# Altium project ECEN2020_Final_Board.PrjPcb
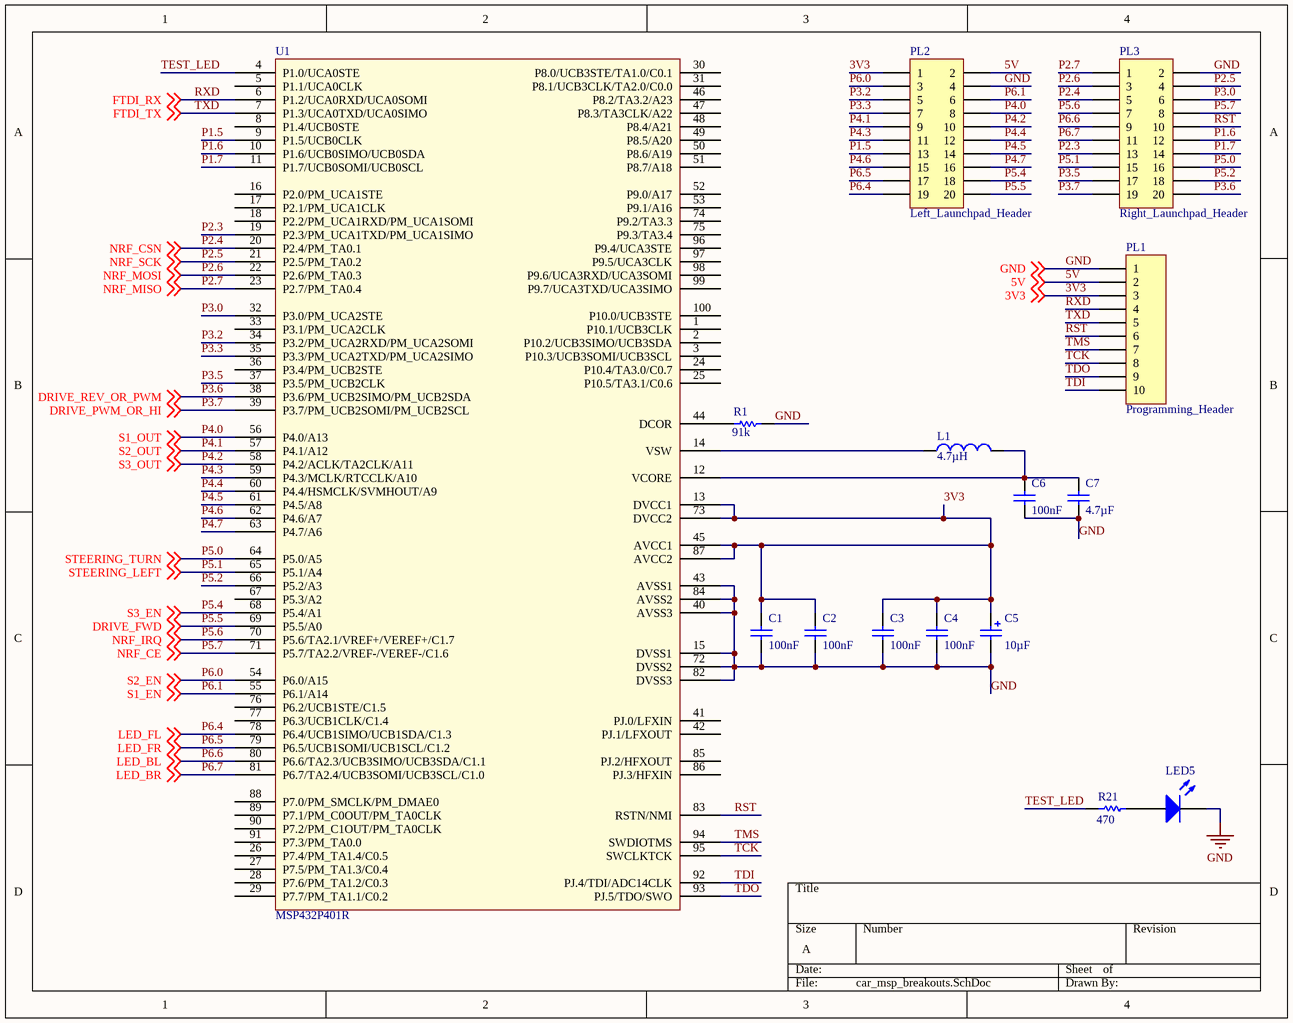
[diagram p0: car_msp_breakouts.SchDoc]
7 sheets, 73 parts. Net scope: global (net labels, ports and power ports of the same name join across sheets).
Board file: car_board.PcbDoc
Sheets:
  car_msp_breakouts.SchDoc
  ftdi.SchDoc
  lights.SchDoc
  motor_driver.SchDoc
  nrf.SchDoc
  power.SchDoc
  sensors.SchDoc

## Sheet car_msp_breakouts.SchDoc
size A; PageSetup: Record=PageOptions|CenterHorizontal=True|CenterVertical=True|PrintScale=1.12|XCorrection=1.00|YCorrection=1.00|PrintKind=1|BorderSize=5000000|LeftOffset=0|BottomOffset=0|Orientation=2|PaperLength=1000|PaperWidth=1000|Scale=100|PaperSource=7|PrintQuality=600|MediaType=1|DitherType=10|PrintScaleMode=1|PaperKind=Letter|PaperIndex=1

### Parts
C1  value 100nF  [0805-C]  (hidden comment: Cap)
C2  value 100nF  [0805-C]  (hidden comment: Cap)
C3  value 100nF  [0805-C]  (hidden comment: Cap)
C4  value 100nF  [0805-C]  (hidden comment: Cap)
C5  value 10µF  [0805-TC]  (hidden comment: Cap Pol1)
C6  value 100nF  [0805-C]  (hidden comment: Cap)
C7  value 4.7µF  [0805-C]  (hidden comment: Cap)
L1  value 4.7µH  [0805-L]  (hidden comment: Inductor)
LED5  LED2  [0805-LED]  (value not drawn)
PL1  Programming_Header  [HDR1X10]
PL2  Left_Launchpad_Header  [HDR2X10]
PL3  Right_Launchpad_Header  [HDR2X10]
R1  value 91k  [0805-R]  (hidden comment: Res1)
R21  value 470  [0805-R]  (hidden comment: Res1)
U1  MSP432P401R  [TSQFP50P1600X1600X160-100N]

### Nets
3V3: C1.2 C2.2 C3.2 C4.2 C5.1 PL1.3 PL2.1 U1.13(DVCC1) U1.45(AVCC1) U1.73(DVCC2) U1.87(AVCC2) ; off-sheet 3V3
GND: C1.1 C2.1 C3.1 C4.1 C5.2 C6.1 C7.1 LED5.2(K) PL1.1 PL2.4 PL3.2 R1.2 U1.15(DVSS1) U1.40(AVSS3) U1.43(AVSS1) U1.72(DVSS2) U1.82(DVSS3) U1.84(AVSS2) ; off-sheet GND
5V: PL1.2 PL2.2 ; off-sheet 5V
P1.5: PL2.13 U1.9(P1.5/UCB0CLK)
P1.6: PL3.12 U1.10(P1.6/UCB0SIMO/UCB0SDA)
P1.7: PL3.14 U1.11(P1.7/UCB0SOMI/UCB0SCL)
P2.3: PL3.13 U1.19(P2.3/PM_UCA1TXD/PM_UCA1SIMO)
P2.4: PL3.5 U1.20(P2.4/PM_TA0.1) ; off-sheet NRF_CSN  [also labelled NRF_CSN]
P2.5: PL3.4 U1.21(P2.5/PM_TA0.2) ; off-sheet NRF_SCK  [also labelled NRF_SCK]
P2.6: PL3.3 U1.22(P2.6/PM_TA0.3) ; off-sheet NRF_MOSI  [also labelled NRF_MOSI]
P2.7: PL3.1 U1.23(P2.7/PM_TA0.4) ; off-sheet NRF_MISO  [also labelled NRF_MISO]
P3.0: PL3.6 U1.32(P3.0/PM_UCA2STE)
P3.2: PL2.5 U1.34(P3.2/PM_UCA2RXD/PM_UCA2SOMI)
P3.3: PL2.7 U1.35(P3.3/PM_UCA2TXD/PM_UCA2SIMO)
P3.5: PL3.17 U1.37(P3.5/PM_UCB2CLK)
P3.6: PL3.20 U1.38(P3.6/PM_UCB2SIMO/PM_UCB2SDA) ; off-sheet DRIVE_REV_OR_PWM  [also labelled DRIVE_REV_OR_PWM]
P3.7: PL3.19 U1.39(P3.7/PM_UCB2SOMI/PM_UCB2SCL) ; off-sheet DRIVE_PWM_OR_HI  [also labelled DRIVE_PWM_OR_HI]
P4.0: PL2.8 U1.56(P4.0/A13) ; off-sheet S1_OUT  [also labelled S1_OUT]
P4.1: PL2.9 U1.57(P4.1/A12) ; off-sheet S2_OUT  [also labelled S2_OUT]
P4.2: PL2.10 U1.58(P4.2/ACLK/TA2CLK/A11) ; off-sheet S3_OUT  [also labelled S3_OUT]
P4.3: PL2.11 U1.59(P4.3/MCLK/RTCCLK/A10)
P4.4: PL2.12 U1.60(P4.4/HSMCLK/SVMHOUT/A9)
P4.5: PL2.14 U1.61(P4.5/A8)
P4.6: PL2.15 U1.62(P4.6/A7)
P4.7: PL2.16 U1.63(P4.7/A6)
P5.0: PL3.16 U1.64(P5.0/A5) ; off-sheet STEERING_TURN  [also labelled STEERING_TURN]
P5.1: PL3.15 U1.65(P5.1/A4) ; off-sheet STEERING_LEFT  [also labelled STEERING_LEFT]
P5.2: PL3.18 U1.66(P5.2/A3)
P5.4: PL2.18 U1.68(P5.4/A1) ; off-sheet S3_EN  [also labelled S3_EN]
P5.5: PL2.20 U1.69(P5.5/A0) ; off-sheet DRIVE_FWD  [also labelled DRIVE_FWD]
P5.6: PL3.7 U1.70(P5.6/TA2.1/VREF+/VEREF+/C1.7) ; off-sheet NRF_IRQ  [also labelled NRF_IRQ]
P5.7: PL3.8 U1.71(P5.7/TA2.2/VREF-/VEREF-/C1.6) ; off-sheet NRF_CE  [also labelled NRF_CE]
P6.0: PL2.3 U1.54(P6.0/A15) ; off-sheet S2_EN  [also labelled S2_EN]
P6.1: PL2.6 U1.55(P6.1/A14) ; off-sheet S1_EN  [also labelled S1_EN]
P6.4: PL2.19 U1.78(P6.4/UCB1SIMO/UCB1SDA/C1.3) ; off-sheet LED_FL  [also labelled LED_FL]
P6.5: PL2.17 U1.79(P6.5/UCB1SOMI/UCB1SCL/C1.2) ; off-sheet LED_FR  [also labelled LED_FR]
P6.6: PL3.9 U1.80(P6.6/TA2.3/UCB3SIMO/UCB3SDA/C1.1) ; off-sheet LED_BL  [also labelled LED_BL]
P6.7: PL3.11 U1.81(P6.7/TA2.4/UCB3SOMI/UCB3SCL/C1.0) ; off-sheet LED_BR  [also labelled LED_BR]
RST: PL1.6 PL3.10 U1.83(RSTN/NMI)
RXD: PL1.4 U1.6(P1.2/UCA0RXD/UCA0SOMI) ; off-sheet FTDI_RX  [also labelled FTDI_RX]
TCK: PL1.8 U1.95(SWCLKTCK)
TDI: PL1.10 U1.92(PJ.4/TDI/ADC14CLK)
TDO: PL1.9 U1.93(PJ.5/TDO/SWO)
TEST_LED: R21.1 U1.4(P1.0/UCA0STE)
TMS: PL1.7 U1.94(SWDIOTMS)
TXD: PL1.5 U1.7(P1.3/UCA0TXD/UCA0SIMO) ; off-sheet FTDI_TX  [also labelled FTDI_TX]
NetC6_2: C6.2 C7.2 L1.2 U1.12(VCORE)
NetL1_1: L1.1 U1.14(VSW)
NetLED5_1: LED5.1(A) R21.2
NetR1_1: R1.1 U1.44(DCOR)

Not connected (* = marked no-connect by the designer): U1 1(P10.1/UCB3CLK) 2(P10.2/UCB3SIMO/UCB3SDA) 3(P10.3/UCB3SOMI/UCB3SCL) 5(P1.1/UCA0CLK) 8(P1.4/UCB0STE) 16(P2.0/PM_UCA1STE) 17(P2.1/PM_UCA1CLK) 18(P2.2/PM_UCA1RXD/PM_UCA1SOMI) 24(P10.4/TA3.0/C0.7) 25(P10.5/TA3.1/C0.6) 26(P7.4/PM_TA1.4/C0.5) 27(P7.5/PM_TA1.3/C0.4) 28(P7.6/PM_TA1.2/C0.3) 29(P7.7/PM_TA1.1/C0.2) 30(P8.0/UCB3STE/TA1.0/C0.1) 31(P8.1/UCB3CLK/TA2.0/C0.0) 33(P3.1/PM_UCA2CLK) 36(P3.4/PM_UCB2STE) 41(PJ.0/LFXIN) 42(PJ.1/LFXOUT) 46(P8.2/TA3.2/A23) 47(P8.3/TA3CLK/A22) 48(P8.4/A21) 49(P8.5/A20) 50(P8.6/A19) 51(P8.7/A18) 52(P9.0/A17) 53(P9.1/A16) 67(P5.3/A2) 74(P9.2/TA3.3) 75(P9.3/TA3.4) 76(P6.2/UCB1STE/C1.5) 77(P6.3/UCB1CLK/C1.4) 85(PJ.2/HFXOUT) 86(PJ.3/HFXIN) 88(P7.0/PM_SMCLK/PM_DMAE0) 89(P7.1/PM_C0OUT/PM_TA0CLK) 90(P7.2/PM_C1OUT/PM_TA0CLK) 91(P7.3/PM_TA0.0) 96(P9.4/UCA3STE) 97(P9.5/UCA3CLK) 98(P9.6/UCA3RXD/UCA3SOMI) 99(P9.7/UCA3TXD/UCA3SIMO) 100(P10.0/UCB3STE)

### Library data of the parts
C1-C4 C6 C7 = Cap: Capacitor; Published: 8-Jun-2000; LatestRevisionDate: 17-Jul-2002; LatestRevisionNote: Re-released for DXP Platform.; PackageReference: RAD-0.3; Publisher: Altium Limited; PackageDescription: Radial Cap, Thru-Hole; 2 Leads; 0.3 in Pin Spacing
C5 = Cap Pol1: Polarized Capacitor (Radial); Published: 8-Jun-2000; LatestRevisionDate: 17-Jul-2002; LatestRevisionNote: Re-released for DXP Platform.; PackageReference: RB7.6-15; Publisher: Altium Limited; PackageDescription: Polarized Capacitor (Radial); 2 Leads
L1 = Inductor: Code_IEC: 1005; Published: 8-Jun-2000; LatestRevisionDate: 29-May-2009; LatestRevisionNote: IPC-7351 Footprint Added.; PackageReference: 0402-A; Publisher: Altium Limited; PackageDescription: Chip Inductor; Code_JEITA: 0402
LED5 = LED2: Typical RED, GREEN, YELLOW, AMBER GaAs LED; Published: 8-Jun-2000; LatestRevisionDate: 17-Jul-2002; LatestRevisionNote: Re-released for DXP Platform.; PackageVersion: Feb-2002; PackageReference: 3.2X1.6X1.1; Publisher: Altium Limited; PackageDescription: SM LED; 2 Flat Leads
PL1 = Header 10: Header, 10-Pin; LatestRevisionDate: 17-Jul-2002; LatestRevisionNote: Re-released for DXP Platform.; Publisher: Altium Limited
PL2 PL3 = Header 10X2: Header, 10-Pin, Dual row; LatestRevisionDate: 17-Jul-2002; LatestRevisionNote: Re-released for DXP Platform.; Publisher: Altium Limited
R1 R21 = Res1: Resistor; Published: 8-Jun-2000; LatestRevisionDate: 17-Jul-2002; LatestRevisionNote: Re-released for DXP Platform.; PackageReference: AXIAL-0.3; Publisher: Altium Limited; PackageDescription: Axial Device, Thru-Hole; 2 Leads; 0.3 in Pin Spacing
U1 = MSP432

## Sheet ftdi.SchDoc
size A
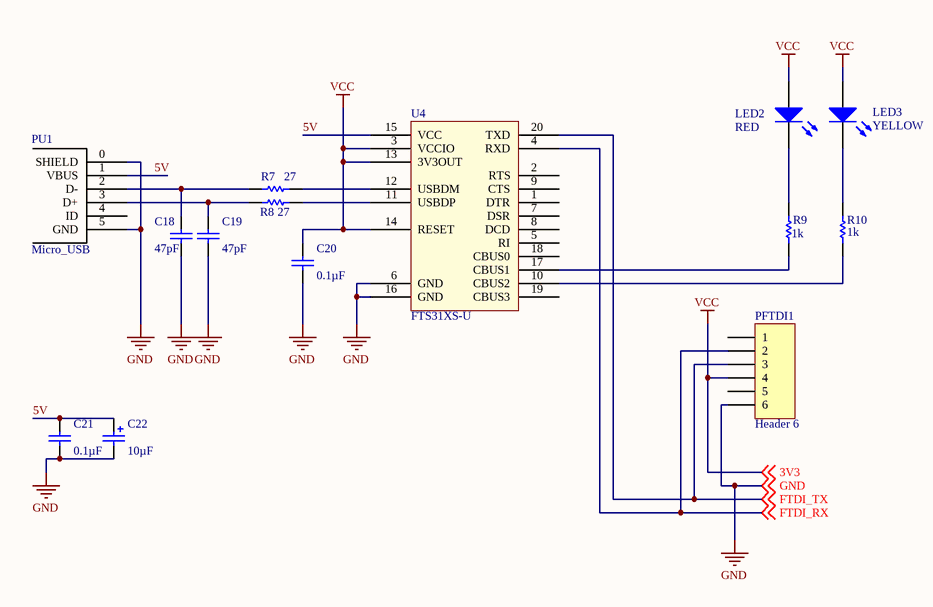
[diagram p1: ftdi.SchDoc]

### Parts
C18  value 47pF  [0805-C]  (hidden comment: Cap)
C19  value 47pF  [0805-C]  (hidden comment: Cap)
C20  value 0.1µF  [0805-C]  (hidden comment: Cap)
C21  value 0.1µF  [0805-C]  (hidden comment: Cap)
C22  value 10µF  [0805-TC]  (hidden comment: Cap Pol1)
LED2  RED  [0805-LED]
LED3  YELLOW  [0805-LED]
PFTDI1  Header 6  [HDR1X6]
PU1  Micro_USB  [Micro_USB]
R7  value 27  [0805-R]  (hidden comment: Res1)
R8  value 27  [0805-R]  (hidden comment: Res1)
R9  value 1k  [0805-R]  (hidden comment: Res1)
R10  value 1k  [0805-R]  (hidden comment: Res1)
U4  FTS31XS-U  [SOP64P570X175-20N]

### Nets
3V3: C20.2 LED2.1(A) LED3.1(A) PFTDI1.4 U4.3(VCCIO) U4.13(3V3OUT) U4.14(RESET) ; off-sheet 3V3  [also labelled VCC]
GND: C18.1 C19.1 C20.1 C21.1 C22.2 PFTDI1.6 PU1.0(SHIELD) PU1.5(GND) U4.6(GND) U4.16(GND) ; off-sheet GND
5V: C21.2 C22.1 PU1.1(VBUS) U4.15(VCC)
FTDI_RX: PFTDI1.2 U4.4(RXD) ; off-sheet FTDI_RX  [project net RXD]
FTDI_TX: PFTDI1.3 U4.20(TXD) ; off-sheet FTDI_TX  [project net TXD]
NetC18_2: C18.2 PU1.2(D-) R7.1
NetC19_2: C19.2 PU1.3(D+) R8.1
NetLED2_2: LED2.2(K) R9.2
NetLED3_2: LED3.2(K) R10.2
NetR7_2: R7.2 U4.12(USBDM)
NetR8_2: R8.2 U4.11(USBDP)
NetR9_1: R9.1 U4.17(CBUS1)
NetR10_1: R10.1 U4.10(CBUS2)

Not connected (* = marked no-connect by the designer): PFTDI1 1 5; PU1 4(ID); U4 1(DTR) 2(RTS) 5(RI) 7(DSR) 8(DCD) 9(CTS) 18(CBUS0) 19(CBUS3)

### Library data of the parts
C18-C21 = Cap: Capacitor; Published: 8-Jun-2000; LatestRevisionDate: 17-Jul-2002; LatestRevisionNote: Re-released for DXP Platform.; PackageReference: RAD-0.3; Publisher: Altium Limited; PackageDescription: Radial Cap, Thru-Hole; 2 Leads; 0.3 in Pin Spacing
C22 = Cap Pol1: Polarized Capacitor (Radial); Published: 8-Jun-2000; LatestRevisionDate: 17-Jul-2002; LatestRevisionNote: Re-released for DXP Platform.; PackageReference: RB7.6-15; Publisher: Altium Limited; PackageDescription: Polarized Capacitor (Radial); 2 Leads
LED2 LED3 = LED2: as LED5 on sheet car_msp_breakouts; Published: 8-Jun-2000; LatestRevisionDate: 17-Jul-2002; LatestRevisionNote: Re-released for DXP Platform.; PackageVersion: Feb-2002; PackageReference: 3.2X1.6X1.1; Publisher: Altium Limited; PackageDescription: SM LED; 2 Flat Leads
PFTDI1 = Header 6: Header, 6-Pin; LatestRevisionDate: 17-Jul-2002; LatestRevisionNote: Re-released for DXP Platform.; Publisher: Altium Limited
R7-R10 = Res1: Resistor; Published: 8-Jun-2000; LatestRevisionDate: 17-Jul-2002; LatestRevisionNote: Re-released for DXP Platform.; PackageReference: AXIAL-0.3; Publisher: Altium Limited; PackageDescription: Axial Device, Thru-Hole; 2 Leads; 0.3 in Pin Spacing

## Sheet lights.SchDoc
size A
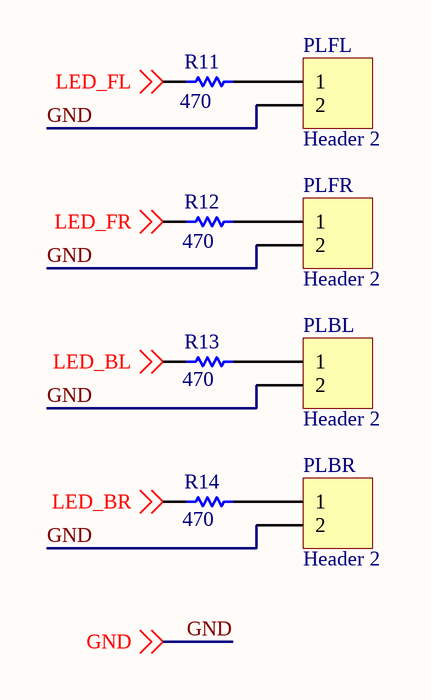
[diagram p2: lights.SchDoc]

### Parts
PLBL  Header 2  [HDR1X2]
PLBR  Header 2  [HDR1X2]
PLFL  Header 2  [HDR1X2]
PLFR  Header 2  [HDR1X2]
R11  value 470  [0805-R]  (hidden comment: Res1)
R12  value 470  [0805-R]  (hidden comment: Res1)
R13  value 470  [0805-R]  (hidden comment: Res1)
R14  value 470  [0805-R]  (hidden comment: Res1)

### Nets
GND: PLBL.2 PLBR.2 PLFL.2 PLFR.2 ; off-sheet GND
LED_BL: R13.1 ; off-sheet LED_BL  [project net P6.6]
LED_BR: R14.1 ; off-sheet LED_BR  [project net P6.7]
LED_FL: R11.1 ; off-sheet LED_FL  [project net P6.4]
LED_FR: R12.1 ; off-sheet LED_FR  [project net P6.5]
NetPLBL_1: PLBL.1 R13.2
NetPLBR_1: PLBR.1 R14.2
NetPLFL_1: PLFL.1 R11.2
NetPLFR_1: PLFR.1 R12.2

### Library data of the parts
PLBL PLBR PLFL PLFR = Header 2: Header, 2-Pin; LatestRevisionDate: 17-Jul-2002; LatestRevisionNote: Re-released for DXP Platform.; Publisher: Altium Limited
R11-R14 = Res1: Resistor; Published: 8-Jun-2000; LatestRevisionDate: 17-Jul-2002; LatestRevisionNote: Re-released for DXP Platform.; PackageReference: AXIAL-0.3; Publisher: Altium Limited; PackageDescription: Axial Device, Thru-Hole; 2 Leads; 0.3 in Pin Spacing

## Sheet motor_driver.SchDoc
size A
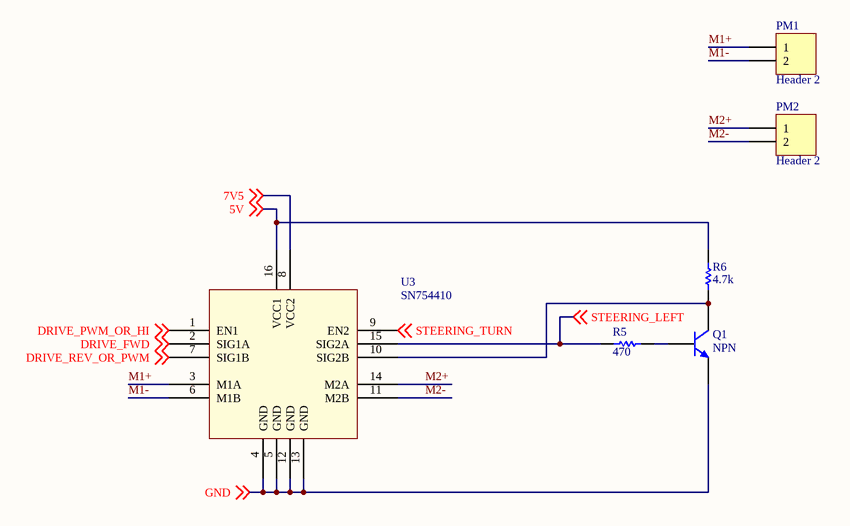
[diagram p3: motor_driver.SchDoc]

### Parts
PM1  Header 2  [HDR1X2]
PM2  Header 2  [HDR1X2]
Q1  NPN  [SOT23]
R5  value 470  [0805-R]  (hidden comment: Res1)
R6  value 4.7k  [0805-R]  (hidden comment: Res1)
U3  SN754410  [DIP16]

### Nets
GND: Q1.3(E) U3.4(GND) U3.5(GND) U3.12(GND) U3.13(GND) ; off-sheet GND
5V: R6.2 U3.16(VCC1) ; off-sheet 5V
7V5: U3.8(VCC2) ; off-sheet 7V5
DRIVE_FWD: U3.2(SIG1A) ; off-sheet DRIVE_FWD  [project net P5.5]
DRIVE_PWM_OR_HI: U3.1(EN1) ; off-sheet DRIVE_PWM_OR_HI  [project net P3.7]
DRIVE_REV_OR_PWM: U3.7(SIG1B) ; off-sheet DRIVE_REV_OR_PWM  [project net P3.6]
M1+: PM1.1 U3.3(M1A)
M1-: PM1.2 U3.6(M1B)
M2+: PM2.1 U3.14(M2A)
M2-: PM2.2 U3.11(M2B)
STEERING_LEFT: R5.1 U3.15(SIG2A) ; off-sheet STEERING_LEFT  [project net P5.1]
STEERING_TURN: U3.9(EN2) ; off-sheet STEERING_TURN  [project net P5.0]
NetQ1_1: Q1.1(C) R6.1 U3.10(SIG2B)
NetQ1_2: Q1.2(B) R5.2

### Library data of the parts
PM1 PM2 = Header 2: Header, 2-Pin; LatestRevisionDate: 17-Jul-2002; LatestRevisionNote: Re-released for DXP Platform.; Publisher: Altium Limited
Q1 = NPN: NPN Bipolar Transistor; pin to pad: 1>3 2>1 3>2; Published: 8-Jun-2000; LatestRevisionDate: 17-Jul-2002; LatestRevisionNote: Re-released for DXP Platform.; PackageReference: TO-226-AA; Publisher: Altium Limited; PackageDescription: TO, Flat Index; 3 In-Line, Axial Leads; Body Dia. 4.8mm; Leads 0.55 x 0.51 mm (max); Code_JEDEC: TO-226-AA
R5 R6 = Res1: Resistor; Published: 8-Jun-2000; LatestRevisionDate: 17-Jul-2002; LatestRevisionNote: Re-released for DXP Platform.; PackageReference: AXIAL-0.3; Publisher: Altium Limited; PackageDescription: Axial Device, Thru-Hole; 2 Leads; 0.3 in Pin Spacing

## Sheet nrf.SchDoc
size A
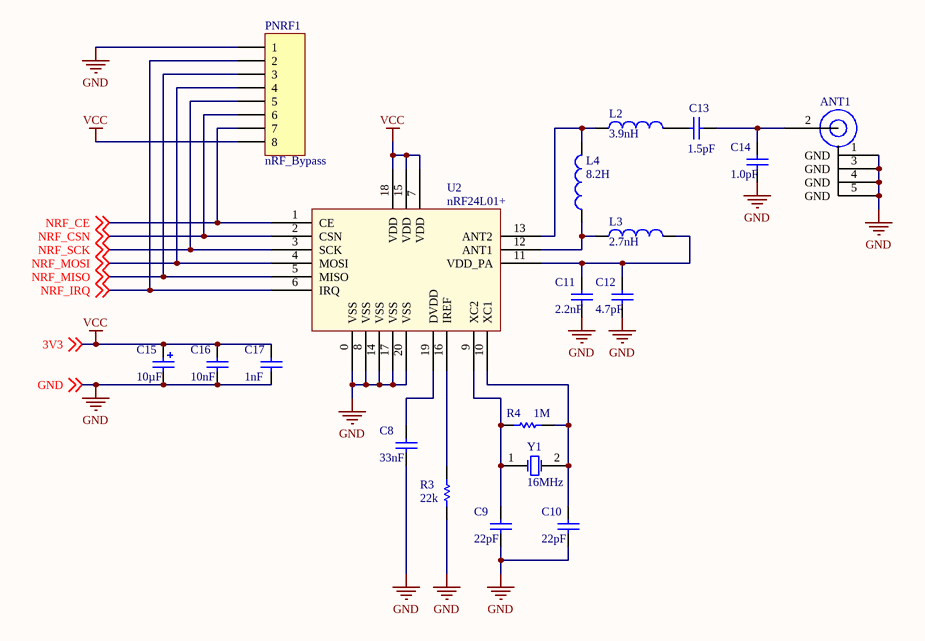
[diagram p4: nrf.SchDoc]

### Parts
ANT1  Connector  [RP-SMA]  (value not drawn)
C8  value 33nF  [0805-C]  (hidden comment: Cap)
C9  value 22pF  [0805-C]  (hidden comment: Cap)
C10  value 22pF  [0805-C]  (hidden comment: Cap)
C11  value 2.2nF  [0805-C]  (hidden comment: Cap)
C12  value 4.7pF  [0805-C]  (hidden comment: Cap)
C13  value 1.5pF  [0805-C]  (hidden comment: Cap)
C14  value 1.0pF  [0805-C]  (hidden comment: Cap)
C15  value 10µF  [0805-TC]  (hidden comment: Cap Pol1)
C16  value 10nF  [0805-C]  (hidden comment: Cap)
C17  value 1nF  [0805-C]  (hidden comment: Cap)
L2  value 3.9nH  [0402-L]  (hidden comment: Inductor)
L3  value 2.7nH  [0402-L]  (hidden comment: Inductor)
L4  value 8.2H  [0402-L]  (hidden comment: Inductor)
PNRF1  nRF_Bypass  [HDR1X8]
R3  value 22k  [0805-R]  (hidden comment: Res1)
R4  value 1M  [0805-R]  (hidden comment: Res1)
U2  nRF24L01+  [QFN50P400X400X95_HS-21N]
Y1  16MHz  [DFNCRY]

### Nets
3V3: C15.1 C16.2 C17.2 PNRF1.8 U2.7(VDD) U2.15(VDD) U2.18(VDD) ; off-sheet 3V3  [also labelled VCC]
GND: ANT1.1(GND) ANT1.3(GND) ANT1.4(GND) ANT1.5(GND) C8.1 C9.1 C10.1 C11.1 C12.1 C14.1 C15.2 C16.1 C17.1 PNRF1.1 R3.1 U2.0(VSS) U2.8(VSS) U2.14(VSS) U2.17(VSS) U2.20(VSS) ; off-sheet GND
NRF_CE: PNRF1.7 U2.1(CE) ; off-sheet NRF_CE  [project net P5.7]
NRF_CSN: PNRF1.6 U2.2(CSN) ; off-sheet NRF_CSN  [project net P2.4]
NRF_IRQ: PNRF1.2 U2.6(IRQ) ; off-sheet NRF_IRQ  [project net P5.6]
NRF_MISO: PNRF1.3 U2.5(MISO) ; off-sheet NRF_MISO  [project net P2.7]
NRF_MOSI: PNRF1.4 U2.4(MOSI) ; off-sheet NRF_MOSI  [project net P2.6]
NRF_SCK: PNRF1.5 U2.3(SCK) ; off-sheet NRF_SCK  [project net P2.5]
NetANT1_2: ANT1.2(ANT) C13.2 C14.2
NetC8_2: C8.2 U2.19(DVDD)
NetC9_2: C9.2 R4.1 U2.9(XC2) Y1.1(OSC1)
NetC10_2: C10.2 R4.2 U2.10(XC1) Y1.2(OSC2)
NetC11_2: C11.2 C12.2 L3.2 U2.11(VDD_PA)
NetC13_1: C13.1 L2.2
NetL2_1: L2.1 L4.2 U2.13(ANT2)
NetL3_1: L3.1 L4.1 U2.12(ANT1)
NetR3_2: R3.2 U2.16(IREF)

### Library data of the parts
ANT1 = Antenna_Connector
C8-C14 C16 C17 = Cap: Capacitor; Published: 8-Jun-2000; LatestRevisionDate: 17-Jul-2002; LatestRevisionNote: Re-released for DXP Platform.; PackageReference: RAD-0.3; Publisher: Altium Limited; PackageDescription: Radial Cap, Thru-Hole; 2 Leads; 0.3 in Pin Spacing
C15 = Cap Pol1: Polarized Capacitor (Radial); Published: 8-Jun-2000; LatestRevisionDate: 17-Jul-2002; LatestRevisionNote: Re-released for DXP Platform.; PackageReference: RB7.6-15; Publisher: Altium Limited; PackageDescription: Polarized Capacitor (Radial); 2 Leads
L2-L4 = Inductor: Code_IEC: 1005; Published: 8-Jun-2000; LatestRevisionDate: 29-May-2009; LatestRevisionNote: IPC-7351 Footprint Added.; PackageReference: 0402-A; Publisher: Altium Limited; PackageDescription: Chip Inductor; Code_JEITA: 0402
PNRF1 = Header 8: Header, 8-Pin; LatestRevisionDate: 17-Jul-2002; LatestRevisionNote: Re-released for DXP Platform.; Publisher: Altium Limited
R3 R4 = Res1: Resistor; Published: 8-Jun-2000; LatestRevisionDate: 17-Jul-2002; LatestRevisionNote: Re-released for DXP Platform.; PackageReference: AXIAL-0.3; Publisher: Altium Limited; PackageDescription: Axial Device, Thru-Hole; 2 Leads; 0.3 in Pin Spacing
Y1 = XTAL: Crystal Oscillator; pin to pad: 2>3; Published: 8-Jun-2000; LatestRevisionDate: 17-Jul-2002; LatestRevisionNote: Re-released for DXP Platform.; PackageReference: R38; Publisher: Altium Limited; PackageDescription: Crystal, Thru-Hole; 2 Leads; Body 3.1 x 8.2 mm (Dia.xH)

## Sheet power.SchDoc
size A
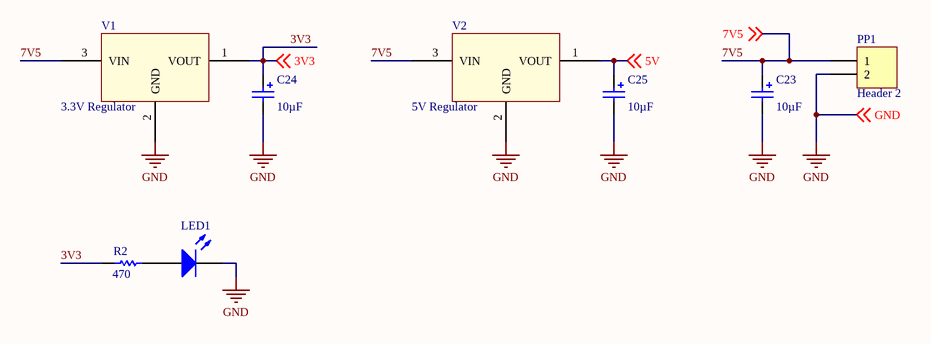
[diagram p5: power.SchDoc]

### Parts
C23  value 10µF  [0805-TC]  (hidden comment: Cap Pol1)
C24  value 10µF  [0805-TC]  (hidden comment: Cap Pol1)
C25  value 10µF  [0805-TC]  (hidden comment: Cap Pol1)
LED1  LED2  [0805-LED]  (value not drawn)
PP1  Header 2  [HDR1X2]
R2  value 470  [0805-R]  (hidden comment: Res1)
V1  3.3V Regulator  [SOT230P700X180-4N]
V2  5V Regulator  [SOT230P700X180-4N]

### Nets
3V3: C24.1 R2.1 V1.1(VOUT) ; off-sheet 3V3
GND: C23.2 C24.2 C25.2 LED1.2(K) PP1.2 V1.2(GND) V2.2(GND) ; off-sheet GND
5V: C25.1 V2.1(VOUT) ; off-sheet 5V
7V5: C23.1 PP1.1 V1.3(VIN) V2.3(VIN) ; off-sheet 7V5
NetLED1_1: LED1.1(A) R2.2

### Library data of the parts
C23-C25 = Cap Pol1: Polarized Capacitor (Radial); Published: 8-Jun-2000; LatestRevisionDate: 17-Jul-2002; LatestRevisionNote: Re-released for DXP Platform.; PackageReference: RB7.6-15; Publisher: Altium Limited; PackageDescription: Polarized Capacitor (Radial); 2 Leads
LED1 = LED2: as LED5 on sheet car_msp_breakouts; Published: 8-Jun-2000; LatestRevisionDate: 17-Jul-2002; LatestRevisionNote: Re-released for DXP Platform.; PackageVersion: Feb-2002; PackageReference: 3.2X1.6X1.1; Publisher: Altium Limited; PackageDescription: SM LED; 2 Flat Leads
PP1 = Header 2: Header, 2-Pin; LatestRevisionDate: 17-Jul-2002; LatestRevisionNote: Re-released for DXP Platform.; Publisher: Altium Limited
R2 = Res1: Resistor; Published: 8-Jun-2000; LatestRevisionDate: 17-Jul-2002; LatestRevisionNote: Re-released for DXP Platform.; PackageReference: AXIAL-0.3; Publisher: Altium Limited; PackageDescription: Axial Device, Thru-Hole; 2 Leads; 0.3 in Pin Spacing
V1 V2 = NCP1117

## Sheet sensors.SchDoc
size A
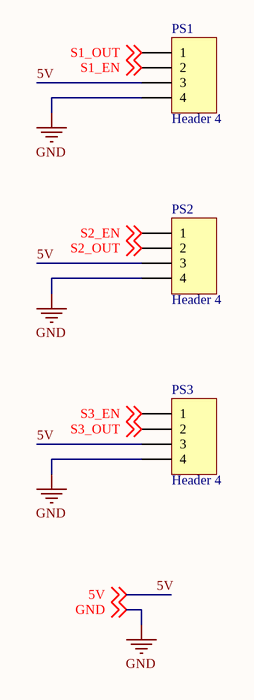
[diagram p6: sensors.SchDoc]

### Parts
PS1  Header 4  [HDR1X4]
PS2  Header 4  [HDR1X4]
PS3  Header 4  [HDR1X4]

### Nets
GND: PS1.4 PS2.4 PS3.4 ; off-sheet GND
5V: PS1.3 PS2.3 PS3.3 ; off-sheet 5V
S1_EN: PS1.2 ; off-sheet S1_EN  [project net P6.1]
S1_OUT: PS1.1 ; off-sheet S1_OUT  [project net P4.0]
S2_EN: PS2.1 ; off-sheet S2_EN  [project net P6.0]
S2_OUT: PS2.2 ; off-sheet S2_OUT  [project net P4.1]
S3_EN: PS3.1 ; off-sheet S3_EN  [project net P5.4]
S3_OUT: PS3.2 ; off-sheet S3_OUT  [project net P4.2]

### Library data of the parts
PS1-PS3 = Header 4: Header, 4-Pin; LatestRevisionDate: 17-Jul-2002; LatestRevisionNote: Re-released for DXP Platform.; Publisher: Altium Limited

## Nets that join several sheets
3V3: car_msp_breakouts (11 pins), ftdi (7 pins), nrf (7 pins), power (C24.1 R2.1 V1.1)
GND: car_msp_breakouts (18 pins), ftdi (10 pins), lights (PLBL.2 PLBR.2 PLFL.2 PLFR.2), motor_driver (5 pins), nrf (20 pins), power (7 pins), sensors (PS1.4 PS2.4 PS3.4)
5V: car_msp_breakouts (PL1.2 PL2.2), ftdi (C21.2 C22.1 PU1.1 U4.15), motor_driver (R6.2 U3.16), power (C25.1 V2.1), sensors (PS1.3 PS2.3 PS3.3)
7V5: motor_driver (U3.8), power (C23.1 PP1.1 V1.3 V2.3)
P2.4: car_msp_breakouts (PL3.5 U1.20), nrf (PNRF1.6 U2.2)
P2.5: car_msp_breakouts (PL3.4 U1.21), nrf (PNRF1.5 U2.3)
P2.6: car_msp_breakouts (PL3.3 U1.22), nrf (PNRF1.4 U2.4)
P2.7: car_msp_breakouts (PL3.1 U1.23), nrf (PNRF1.3 U2.5)
P3.6: car_msp_breakouts (PL3.20 U1.38), motor_driver (U3.7)
P3.7: car_msp_breakouts (PL3.19 U1.39), motor_driver (U3.1)
P4.0: car_msp_breakouts (PL2.8 U1.56), sensors (PS1.1)
P4.1: car_msp_breakouts (PL2.9 U1.57), sensors (PS2.2)
P4.2: car_msp_breakouts (PL2.10 U1.58), sensors (PS3.2)
P5.0: car_msp_breakouts (PL3.16 U1.64), motor_driver (U3.9)
P5.1: car_msp_breakouts (PL3.15 U1.65), motor_driver (R5.1 U3.15)
P5.4: car_msp_breakouts (PL2.18 U1.68), sensors (PS3.1)
P5.5: car_msp_breakouts (PL2.20 U1.69), motor_driver (U3.2)
P5.6: car_msp_breakouts (PL3.7 U1.70), nrf (PNRF1.2 U2.6)
P5.7: car_msp_breakouts (PL3.8 U1.71), nrf (PNRF1.7 U2.1)
P6.0: car_msp_breakouts (PL2.3 U1.54), sensors (PS2.1)
P6.1: car_msp_breakouts (PL2.6 U1.55), sensors (PS1.2)
P6.4: car_msp_breakouts (PL2.19 U1.78), lights (R11.1)
P6.5: car_msp_breakouts (PL2.17 U1.79), lights (R12.1)
P6.6: car_msp_breakouts (PL3.9 U1.80), lights (R13.1)
P6.7: car_msp_breakouts (PL3.11 U1.81), lights (R14.1)
RXD: car_msp_breakouts (PL1.4 U1.6), ftdi (PFTDI1.2 U4.4)
TXD: car_msp_breakouts (PL1.5 U1.7), ftdi (PFTDI1.3 U4.20)